# EAGLE design Mixer (EAGLE 9.6.2)
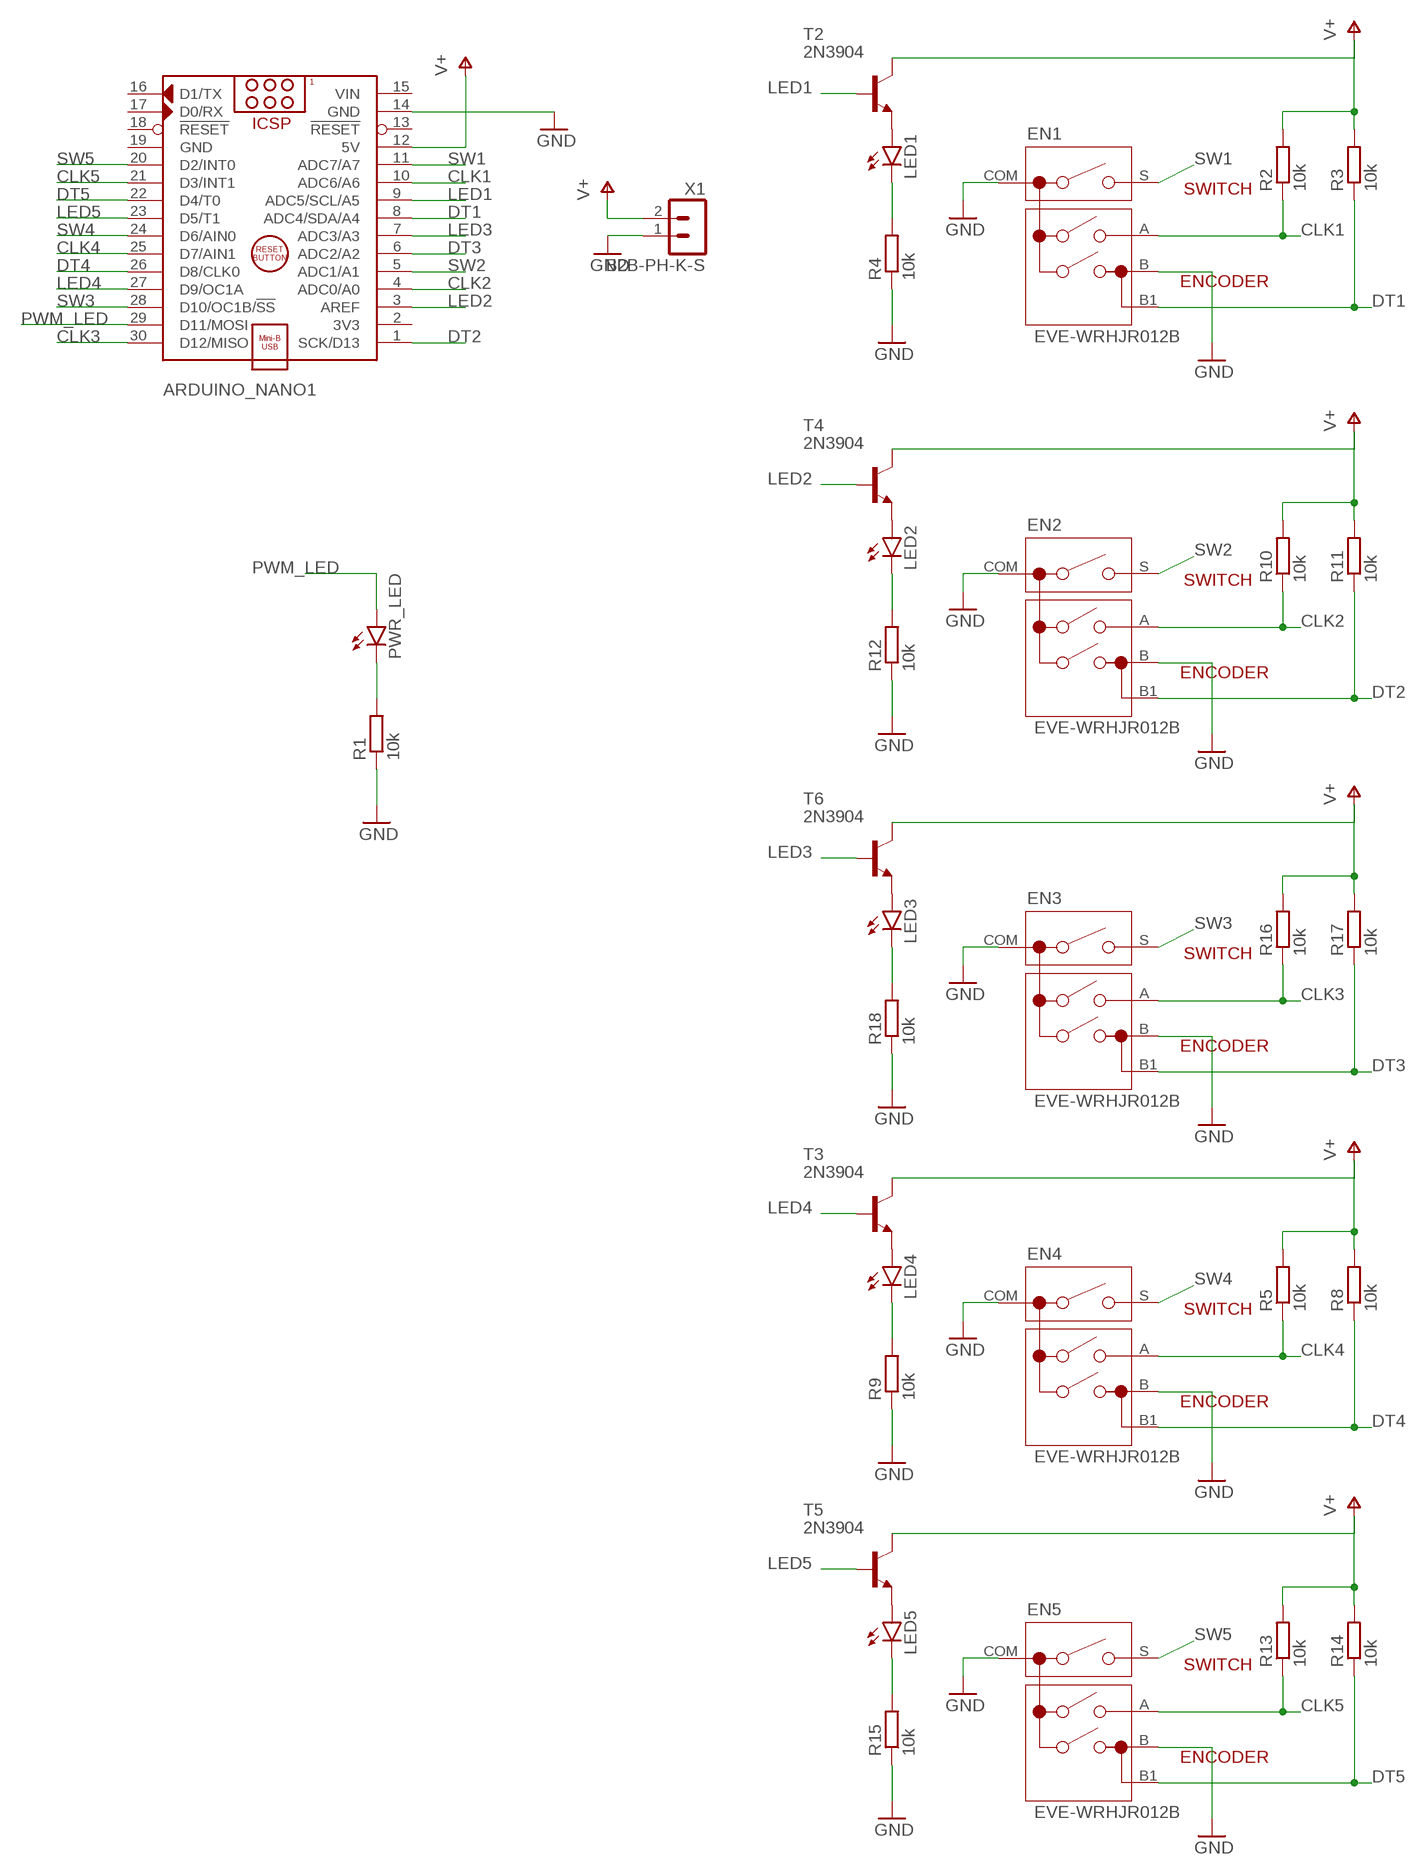
[diagram p0: schematic, sheet 1]

## Parts
ARDUINO_NANO1  ARDUINO_NANO  [ARDUINO_NANO]
EN1  EVE-WRHJR012B  [EVE-WRHJR012B]
EN2  EVE-WRHJR012B  [EVE-WRHJR012B]
EN3  EVE-WRHJR012B  [EVE-WRHJR012B]
EN4  EVE-WRHJR012B  [EVE-WRHJR012B]
EN5  EVE-WRHJR012B  [EVE-WRHJR012B]
LED1  LED5MM  [LED5MM]
LED2  LED5MM  [LED5MM]
LED3  LED5MM  [LED5MM]
LED4  LED5MM  [LED5MM]
LED5  LED5MM  [LED5MM]
PWR_LED  LED5MM  [LED5MM]
R1  10k  R-EU_0207/10  [0207/10]
R2  10k  R-EU_0207/10  [0207/10]
R3  10k  R-EU_0207/10  [0207/10]
R4  10k  R-EU_0207/10  [0207/10]
R5  10k  R-EU_0207/10  [0207/10]
R8  10k  R-EU_0207/10  [0207/10]
R9  10k  R-EU_0207/10  [0207/10]
R10  10k  R-EU_0207/10  [0207/10]
R11  10k  R-EU_0207/10  [0207/10]
R12  10k  R-EU_0207/10  [0207/10]
R13  10k  R-EU_0207/10  [0207/10]
R14  10k  R-EU_0207/10  [0207/10]
R15  10k  R-EU_0207/10  [0207/10]
R16  10k  R-EU_0207/10  [0207/10]
R17  10k  R-EU_0207/10  [0207/10]
R18  10k  R-EU_0207/10  [0207/10]
T2  2N3904  [TO92]
T3  2N3904  [TO92]
T4  2N3904  [TO92]
T5  2N3904  [TO92]
T6  2N3904  [TO92]
X1  B2B-PH-K-S  [B2B-PH-K-S]

## Nets
CLK1: ARDUINO_NANO1.10(ADC6/A6) EN1.A R2.1
CLK2: ARDUINO_NANO1.4(ADC0/A0) EN2.A R10.1
CLK3: ARDUINO_NANO1.30(D12/MISO) EN3.A R16.1
CLK4: ARDUINO_NANO1.25(D7/AIN1) EN4.A R5.1
CLK5: ARDUINO_NANO1.21(D3/INT1) EN5.A R13.1
DT1: ARDUINO_NANO1.8(ADC4/SDA/A4) EN1.B1 R3.1
DT2: ARDUINO_NANO1.1(SCK/D13) EN2.B1 R11.1
DT3: ARDUINO_NANO1.6(ADC2/A2) EN3.B1 R17.1
DT4: ARDUINO_NANO1.26(D8/CLK0) EN4.B1 R8.1
DT5: ARDUINO_NANO1.22(D4/T0) EN5.B1 R14.1
GND: ARDUINO_NANO1.14(GND) EN1.B EN1.COM EN2.B EN2.COM EN3.B EN3.COM EN4.B EN4.COM EN5.B EN5.COM R1.1 R4.1 R9.1 R12.1 R15.1 R18.1 X1.1
LED1: ARDUINO_NANO1.9(ADC5/SCL/A5) T2.2(B)
LED2: ARDUINO_NANO1.3(AREF) T4.2(B)
LED3: ARDUINO_NANO1.7(ADC3/A3) T6.2(B)
LED4: ARDUINO_NANO1.27(D9/OC1A) T3.2(B)
LED5: ARDUINO_NANO1.23(D5/T1) T5.2(B)
N$1: PWR_LED.K(C) R1.2
N$3: LED1.K(C) R4.2
N$4: LED1.A T2.3(E)
N$5: LED4.K(C) R9.2
N$6: LED4.A T3.3(E)
N$7: LED2.K(C) R12.2
N$8: LED2.A T4.3(E)
N$9: LED5.K(C) R15.2
N$10: LED5.A T5.3(E)
N$11: LED3.K(C) R18.2
N$12: LED3.A T6.3(E)
PWM_LED: ARDUINO_NANO1.29(D11/MOSI) PWR_LED.A
SW1: ARDUINO_NANO1.11(ADC7/A7) EN1.S
SW2: ARDUINO_NANO1.5(ADC1/A1) EN2.S
SW3: ARDUINO_NANO1.28(D10/OC1B/!SS) EN3.S
SW4: ARDUINO_NANO1.24(D6/AIN0) EN4.S
SW5: ARDUINO_NANO1.20(D2/INT0) EN5.S
V+: ARDUINO_NANO1.12(5V) R2.2 R3.2 R5.2 R8.2 R10.2 R11.2 R13.2 R14.2 R16.2 R17.2 T2.1(C) T3.1(C) T4.1(C) T5.1(C) T6.1(C) X1.2
Unconnected: ARDUINO_NANO1.2(3V3) ARDUINO_NANO1.13(!RESET) ARDUINO_NANO1.16(D1/TX) ARDUINO_NANO1.17(D0/RX) ARDUINO_NANO1.18(!RESET)

## Power pins joined to a net without a drawn wire
GND: ARDUINO_NANO1.19(GND)
VIN: ARDUINO_NANO1.15(VIN)

## Library data of the parts
ARDUINO_NANO1 = ArduinoNanoV30:ARDUINO_NANO: Arduino Nano V3.0 Module Overview: The Arduino Nano is a small, complete, and breadboard-friendly board based on the ATmega328 (Arduino Nano 3.x) or ATmega168 (Arduino Nano 2.x). It has more or less the same functionality of the Arduino Duemilanove, but in a different package. It lacks only a DC power jack, and works with a Mini-B USB cable instead of a standard one. The Nano was designed and is being produced by Gravitech <http://www.gravitech.us/arna30wiatp.html>. General specifications: Item Value Microcontroller Atmel ATmega168 or ATmega328 Operating Voltage (logic level) 5 V Input Voltage (recommended) 7-12 V Input Voltage (limits) 6-20 V Digital I/O Pins 14 (of which 6 provide PWM output) Analog Input Pins 8 DC Current per I/O Pin 40 mA Flash Memory 16 KB (ATmega168) or 32 KB (ATmega328) of which 2 KB used by bootloader SRAM 1 KB (ATmega168) or 2 KB (ATmega328) EEPROM 512 bytes (ATmega168) or 1 KB (ATmega328) Clock Speed 16 MHz Dimensions (Inches) 0.73" x 1.70" Dimensions (mm) 18mm x 45mm Overall height About 9 mm (not including pins) Weigth 5 g Power: The Arduino Nano can be powered via the Mini-B USB connection, 6-20V unregulated external power supply (pin 30), or 5V regulated external power supply (pin 27). The power source is automatically selected to the highest voltage source. Memory: The ATmega168 has 16 KB of flash memory for storing code (of which 2 KB is used for the bootloader); the ATmega328 has 32 KB, (also with 2 KB used for the bootloader). The ATmega168 has 1 KB of SRAM and 512 bytes of EEPROM (which can be read and written with the EEPROM library); the ATmega328 has 2 KB of SRAM and 1 KB of EEPROM. Input and Output: Each of the 14 digital pins on the Nano can be used as an input or output, using pinMode(), digitalWrite(), and digitalRead() functions. They operate at 5 volts. Each pin can provide or receive a maximum of 40 mA and has an internal pull-up resistor (disconnected by default) of 20-50 kOhms. In addition, some pins have specialized functions. Visit Arduino - ArduinoBoardNano <https://www.arduino.cc/en/Main/ArduinoBoardNano>
EN1-EN5 = Encoders:EVE-WRHJR012B: ROTARY ENCODER MECHANICAL 12PPR Manufacturer's datasheet <https://media.digikey.com/pdf/Data%20Sheets/Panasonic%20Switches%20PDFs/EVEWRHJR012B.pdf>; CREATED_BY: PCBLayout.com; DIGIKEY_PARTNO: P15917-ND; MANUFACTURER: Panasonic Electronic Components; MPN: EVE-WRHJR012B
LED1-LED5 PWR_LED = led:LED: LED OSRAM: - CHIPLED LG R971, LG N971, LY N971, LG Q971, LY Q971, LO R971, LY R971 LH N974, LH R974 LS Q976, LO Q976, LY Q976 LO Q996 - Hyper CHIPLED LW Q18S LB Q993, LB Q99A, LB R99A - SideLED LS A670, LO A670, LY A670, LG A670, LP A670 LB A673, LV A673, LT A673, LW A673 LH A674 LY A675 LS A676, LA A676, LO A676, LY A676, LW A676 LS A679, LY A679, LG A679 - Hyper Micro SIDELED® LS Y876, LA Y876, LO Y876, LY Y876 LT Y87S - SmartLED LW L88C, LW L88S LB L89C, LB L89S, LG L890 LS L89K, LO L89K, LY L89K LS L896, LA L896, LO L896, LY L896 - TOPLED LS T670, LO T670, LY T670, LG T670, LP T670 LSG T670, LSP T670, LSY T670, LOP T670, LYG T670 LG T671, LOG T671, LSG T671 LB T673, LV T673, LT T673, LW T673 LH T674 LS T676, LA T676, LO T676, LY T676, LB T676, LH T676, LSB T676, LW T676 LB T67C, LV T67C, LT T67C, LS T67K, LO T67K, LY T67K, LW E67C LS E67B, LA E67B, LO E67B, LY E67B, LB E67C, LV E67C, LT E67C LW T67C LS T679, LY T679, LG T679 LS T770, LO T770, LY T770, LG T770, LP T770 LB T773, LV T773, LT T773, LW T773 LH T774 LS E675, LA E675, LY E675, LS T675 LS T776, LA T776, LO T776, LY T776, LB T776 LHGB T686 LT T68C, LB T68C - Hyper Mini TOPLED® LB M676 - Mini TOPLED Santana® LG M470 LS M47K, LO M47K, LY M47K Source: http://www.osram.convergy.de LUXEON: - LUMILED® LXK2-PW12-R00, LXK2-PW12-S00, LXK2-PW14-U00, LXK2-PW14-V00 LXK2-PM12-R00, LXK2-PM12-S00, LXK2-PM14-U00 LXK2-PE12-Q00, LXK2-PE12-R00, LXK2-PE12-S00, LXK2-PE14-T00, LXK2-PE14-U00 LXK2-PB12-K00, LXK2-PB12-L00, LXK2-PB12-M00, LXK2-PB14-N00, LXK2-PB14-P00, LXK2-PB14-Q00 LXK2-PR12-L00, LXK2-PR12-M00, LXK2-PR14-Q00, LXK2-PR14-R00 LXK2-PD12-Q00, LXK2-PD12-R00, LXK2-PD12-S00 LXK2-PH12-R00, LXK2-PH12-S00 LXK2-PL12-P00, LXK2-PL12-Q00, LXK2-PL12-R00 Source: www.luxeon.com KINGBRIGHT: KA-3528ASYC Source: www.kingbright.com
R1-R5 R8-R18 = rcl:R-EU_: RESISTOR, European symbol; SPICEPREFIX: R
T2-T6 = transistor:2N3904: NPN TRANSISTOR
X1 = con-JST PH:B2B-PH: JST PH series header 2.00mm pitch disconnectable crimp style connectors, vertical (side entry type), 2 pins

## Board
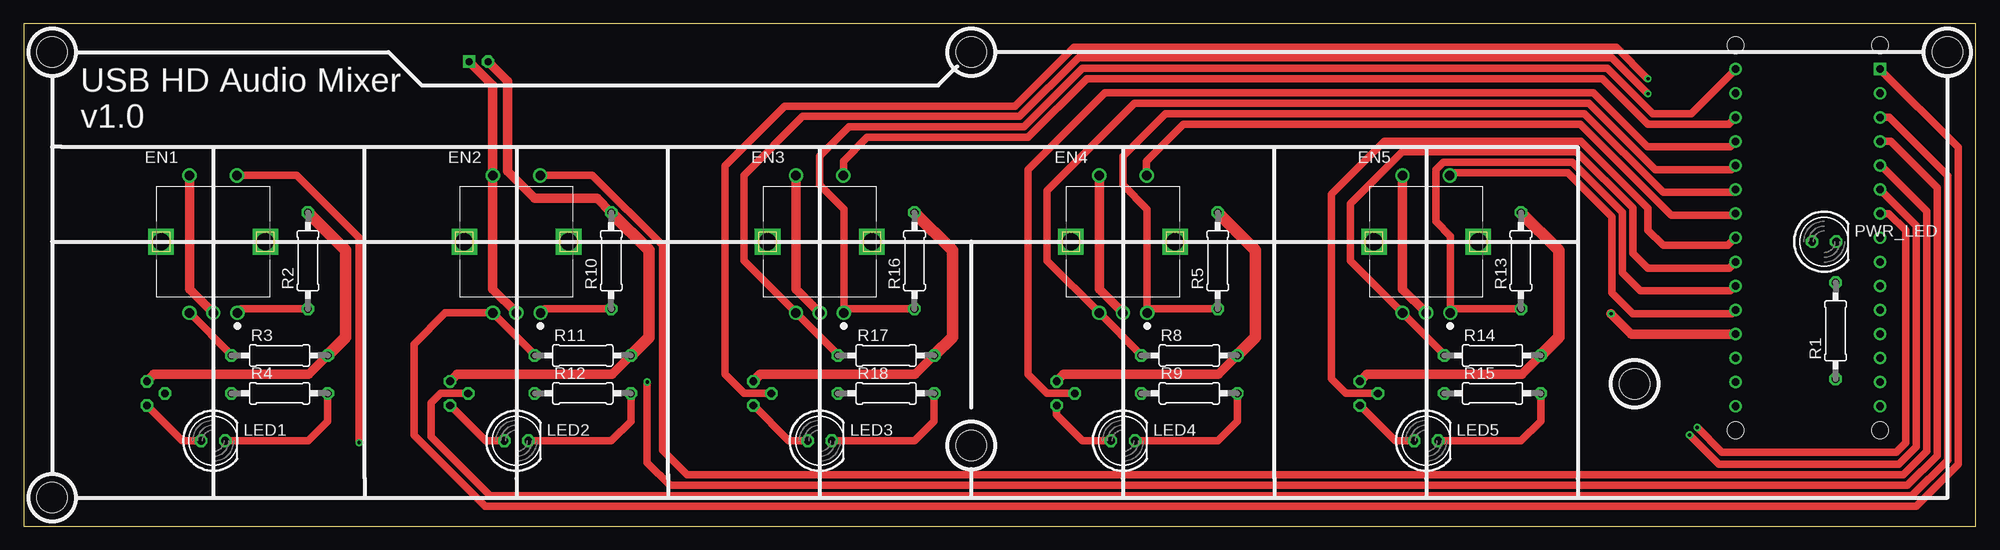
[diagram p1: board, top side]
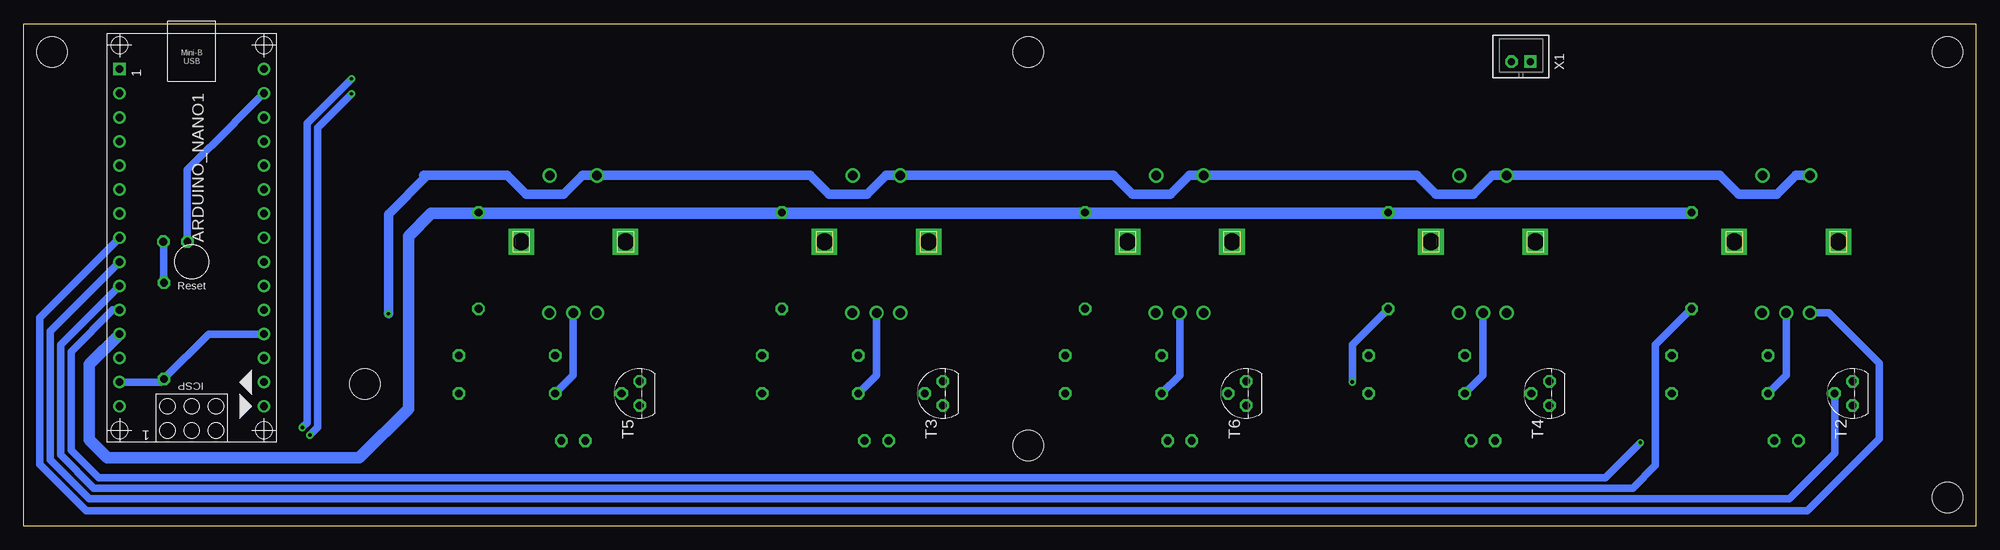
[diagram p2: board, bottom side, seen from below]

Size 206 x 53 mm. Coordinates in mm from the lower left corner, seen from the top.
Outline: 0,0 206,0 206,53 0,53 0,0
Copper layers (1*16): Top 0.035mm / dielectric 1.5mm / Bottom 0.035mm
Design rules "default *": minimum track width 6mil, minimum drill 0.35mm, track to track 12mil, track to pad 6mil, pad to pad 6mil, via to via 6mil, smd to smd 6mil, copper to edge 40mil, drill to drill 6mil, minimum pad ring 10mil, minimum via ring 8mil, stop-mask expansion 4mil, vias tented up to drill 0mil, thermal gap 10mil
Holes 3.2 mm at 3,3 3,50 203,50 100,50 170,15 100,8.5

### Footprints (pad centres in the part's own frame; a part is rotated, then mirrored left to right if it is on the bottom)
ARDUINO_NANO = drill 0.8 square: 1 -20.32,-7.62 | drill 0.8: 2 -17.78,-7.62; 3 -15.24,-7.62; 4 -12.7,-7.62; 5 -10.16,-7.62; 6 -7.62,-7.62; 7 -5.08,-7.62; 8 -2.54,-7.62; 9 0,-7.62; 10 2.54,-7.62; 11 5.08,-7.62; 12 7.62,-7.62; 13 10.16,-7.62; 14 12.7,-7.62; 15 15.24,-7.62; 16 15.24,7.62; 17 12.7,7.62; 18 10.16,7.62; 19 7.62,7.62; 20 5.08,7.62; 21 2.54,7.62; 22 0,7.62; 23 -2.54,7.62; 24 -5.08,7.62; 25 -7.62,7.62; 26 -10.16,7.62; 27 -12.7,7.62; 28 -15.24,7.62; 29 -17.78,7.62; 30 -20.32,7.62 | hole 1.778: -22.86,-7.62; -22.86,7.62; 17.78,7.62; 17.78,-7.62
EVE-WRHJR012B = drill 1: A 2.55,-7.5; B 0,-7.5; B1 -2.5,-7.5; COM -2.5,7; S 2.5,7 | drill 1.8 square: M1 -5.5,0; M2 5.5,0
LED5MM = drill 0.813 octagon: A -1.27,0; K 1.27,0
0207/10 = drill 0.813 octagon: 1 -5.08,0; 2 5.08,0
TO92 = drill 0.813 octagon: 1 1.27,0; 2 0,1.905; 3 -1.27,0
B2B-PH-K-S = drill 0.75 pad 1.3 square: 1 1,0 | drill 0.75 pad 1.3 octagon: 2 -1,0

### Placement (x,y rotation side)
ARDUINO_NANO1  188.27,27.88 270 bottom
EN1  20,30 0 top
EN2  52,30 0 top
EN3  84,30 0 top
EN4  116,30 0 top
EN5  148,30 0 top
LED1  20,9 0 top
LED2  52,9 0 top
LED3  84,9 0 top
LED4  116,9 0 top
LED5  148,9 0 top
PWR_LED  190,30 0 top
R1  191.2,20.6 90 top
R2  30,28 90 top
R3  27,18 0 top
R4  27,14 0 top
R5  126,28 90 top
R8  123,18 0 top
R9  123,14 0 top
R10  62,28 90 top
R11  59,18 0 top
R12  59,14 0 top
R13  158,28 90 top
R14  155,18 0 top
R15  155,14 0 top
R16  94,28 90 top
R17  91,18 0 top
R18  91,14 0 top
T2  13,14 90 bottom
T3  109,14 90 bottom
T4  45,14 90 bottom
T5  141,14 90 bottom
T6  77,14 90 bottom
X1  48,49 0 bottom

### Tracks (layer width: path | path; a pad name or v marks a point on that pad's centre or on a via)
CLK1
  Top 0.8: EN1.A 22.97,22.92 R2.1
  Bottom 0.8: R2.1 33.8,19.12 33.8,6.4 36.2,4 198.6,4 202.1,7.5 202.1,19.12 ARDUINO_NANO1.10
CLK2  (via drill 0.35)
  Top 0.8: EN2.A 54.97,22.92 R10.1 | v65.8,15.2 65.8,6.71 68.2,4.3 198.79,4.3 201.91,7.43 201.91,35.69 197.02,40.58 ARDUINO_NANO1.4
  Bottom 0.8: R10.1 65.8,19.12 v65.8,15.2
CLK3
  Top 0.8: R16.1 86.97,22.92 EN3.A 86.55,33.45 84,36 84,39 87.11,42.1 105.54,42.1 111.74,48.3 167.09,48.3 171.9,43.51 175.96,43.51 ARDUINO_NANO1.30
CLK4
  Top 0.8: R5.1 118.97,22.92 EN4.A 118.55,33.45 116,36 116,39 120.5,43.51 164.71,43.51 173.01,35.2 180.35,35.2 ARDUINO_NANO1.25
CLK5
  Top 0.8: R13.1 150.97,22.92 EN5.A 150.55,30.6 149,32.15 149,37.6 149.8,38.4 163.4,38.4 168.69,33.1 168.69,26.7 170.6,24.8 180.11,24.8 ARDUINO_NANO1.21
DT1
  Top 0.8: R3.1 21.92,18.08 EN1.B1
  Bottom 0.8: EN1.B1 15.5,22.5 10.2,17.2 10.2,9.2 17.8,1.6 199.4,1.6 204.31,6.51 204.31,22 ARDUINO_NANO1.8
DT2
  Top 0.8: R11.1 53.92,18.08 EN2.B1 44.5,22.5 41.2,19.2 41.2,9.6 48.7,2.1 199.71,2.1 204.12,6.51 204.12,39.97 ARDUINO_NANO1.1
DT3  (via drill 0.35)
  Top 0.8: R17.1 85.92,18.08 EN3.B1 76,28 76,37 82.21,43.21 105.08,43.21 111.28,49.41 167.59,49.41 v171.4,45.6 | v175.8,9.6 178.89,6.51 197.88,6.51 199.71,8.34 199.71,31.7 ARDUINO_NANO1.6
  Bottom 0.8: v171.4,45.6 175,42 175,10.4 v175.8,9.6
DT4
  Top 0.8: R8.1 117.92,18.08 EN4.B1 108,28 108,35.4 117.21,44.61 165.16,44.61 172.18,37.6 180.21,37.6 ARDUINO_NANO1.26
DT5
  Top 0.8: R14.1 149.92,18.08 EN5.B1 140,28 140,34 145.5,39.51 163.86,39.51 169.8,33.56 169.8,28.8 171.4,27.2 179.97,27.2 ARDUINO_NANO1.22
GND  (via drill 0.35)
  Top 1: EN1.COM 17.5,25 EN1.B | EN2.B 49.5,25 EN2.COM 49.5,46.5 X1.1 | EN3.COM 81.5,25 EN3.B | EN4.COM 113.5,25 EN4.B | EN5.COM 145.5,25 EN5.B | ARDUINO_NANO1.19 169.65,20.26 v167.51,22.4
  Bottom 0.8: ARDUINO_NANO1.19 186.46,20.26 R1.1 191.54,15.18 ARDUINO_NANO1.14
  Bottom 0.813: EN1.B 20,15.92 R4.1 | EN2.B 52,15.92 R12.1 | EN3.B 84,15.92 R18.1 | EN4.B 116,15.92 R9.1 | EN5.B 148,15.92 R15.1
  Bottom 1: 163.4,37 167.51,32.89 v167.51,22.4 | 35,37 EN2.COM
  Bottom 1.016: EN1.COM 19,37 21,35 25,35 27,37 35,37 | EN2.COM 51,37 53,35 57,35 59,37 EN3.COM 83,37 85,35 89,35 91,37 EN4.COM 115,37 117,35 121,35 123,37 EN5.COM 147,37 149,35 153,35 155,37 163.4,37 163.8,37
LED1
  Bottom 0.8: ARDUINO_NANO1.9 203.21,20.56 203.21,7.01 199.09,2.9 19.7,2.9 14.9,7.7 T2.2
LED2
  Top 0.8: ARDUINO_NANO1.3 196.88,43.12 203.02,36.98 203.02,6.97 199.25,3.2 49.2,3.2 43,9.4 43,13 44,14 T4.2
LED3  (via drill 0.35)
  Top 0.8: v171.4,47.2 171.36,47.2 168.05,50.51 110.83,50.51 104.63,44.31 80.31,44.31 74,38 74,16 76,14 T6.2 | v176.6,10.4 179.21,7.79 197.59,7.79 198.6,8.8 198.6,31.2 196.84,32.96 ARDUINO_NANO1.7
  Bottom 0.8: v171.4,47.2 176.1,42.49 176.1,10.89 v176.6,10.4
LED4
  Top 0.8: ARDUINO_NANO1.27 180.07,40 171.34,40 165.62,45.71 114.11,45.71 106,37.6 106,16 108,14 T3.2
LED5
  Top 0.8: ARDUINO_NANO1.23 179.83,29.6 173,29.6 171.4,31.2 171.4,33.52 164.31,40.61 145.05,40.61 145.04,40.6 143.6,40.6 138,35 138,15.55 139.56,14 T5.2
N$1
  Bottom 0.8: PWR_LED.K 191.2,29.93 R1.2
N$3
  Top 0.8: R4.2 32.08,11.08 30,9 LED1.K
N$4
  Top 0.8: LED1.A 16.73,9 T2.3
N$5
  Top 0.8: R9.2 128.08,11.08 126,9 LED4.K
N$6
  Top 0.8: T3.3 109,11.73 111.73,9 LED4.A
N$7
  Top 0.8: R12.2 64.08,11.08 62,9 LED2.K
N$8
  Top 0.8: LED2.A 48.73,9 T4.3
N$9
  Top 0.8: R15.2 160.08,11.08 158,9 LED5.K
N$10
  Top 0.8: LED5.A 144.73,9 T5.3
N$11
  Top 0.8: R18.2 96.08,11.08 94,9 LED3.K
N$12
  Top 0.8: LED3.A 80.73,9 T6.3
PWM_LED
  Bottom 0.8: ARDUINO_NANO1.29 183.66,42.66 183.81,42.51 188.73,37.58 PWR_LED.A
SW1  (via drill 0.35)
  Top 0.8: EN1.S 28.8,37 35.4,30.4 v35.4,8.8
  Bottom 0.8: v35.4,8.8 39.09,5.11 198.1,5.11 201,8 201,18.4 196.6,22.8 ARDUINO_NANO1.11
SW2
  Top 0.8: EN2.S 60,37 67.4,29.6 67.4,8 69.99,5.41 198.33,5.41 200.81,7.88 200.81,33.19 195.96,38.04 ARDUINO_NANO1.5
SW3
  Top 0.8: EN3.S 86.5,38.5 89,41 106,41 112.2,47.2 166.6,47.2 171.4,42.4 179.93,42.4 ARDUINO_NANO1.28
SW4
  Top 0.8: EN4.S 118.5,38.5 122.4,42.4 164.25,42.4 173.85,32.8 180.49,32.8 ARDUINO_NANO1.24
SW5
  Top 0.8: EN5.S 150.8,37 151.09,37.3 162.94,37.3 167.59,32.65 167.59,24.61 169.8,22.4 180.25,22.4 ARDUINO_NANO1.20
V+
  Top 1: X1.2 51.09,46.91 51.09,37.42 53.92,34.59 60.49,34.59 R10.2 | R3.2 30.08,16 13.73,16 T2.1 | R11.2 62.08,16 45.73,16 T4.1 | R17.2 94.08,16 77.73,16 T6.1 | R8.2 126.08,16 109.73,16 T3.1 | R14.2 158.08,16 141.73,16 T5.1
  Top 1.2: R2.2 34,29.08 34,19.92 R3.2 | R10.2 66,29.08 66,19.92 R11.2 | R16.2 98,29.08 98,19.92 R17.2 | R5.2 130,29.08 130,19.92 R8.2 | R13.2 162,29.08 162,19.92 R14.2
  Bottom 1.2: R2.2 30.08,33 61.92,33 R10.2 62.08,33 93.92,33 R16.2 94.08,33 125.92,33 R5.2 126.08,33 157.92,33 R13.2 158.08,33 163,33 165.4,30.6 165.4,12.4 170.6,7.2 197.19,7.2 199.09,9.1 199.09,17.05 ARDUINO_NANO1.12

### Text on the board
tPlace: USB HD Audio Mixer / v1.0